# Altium schematic sheet rx_board.SchDoc
size A
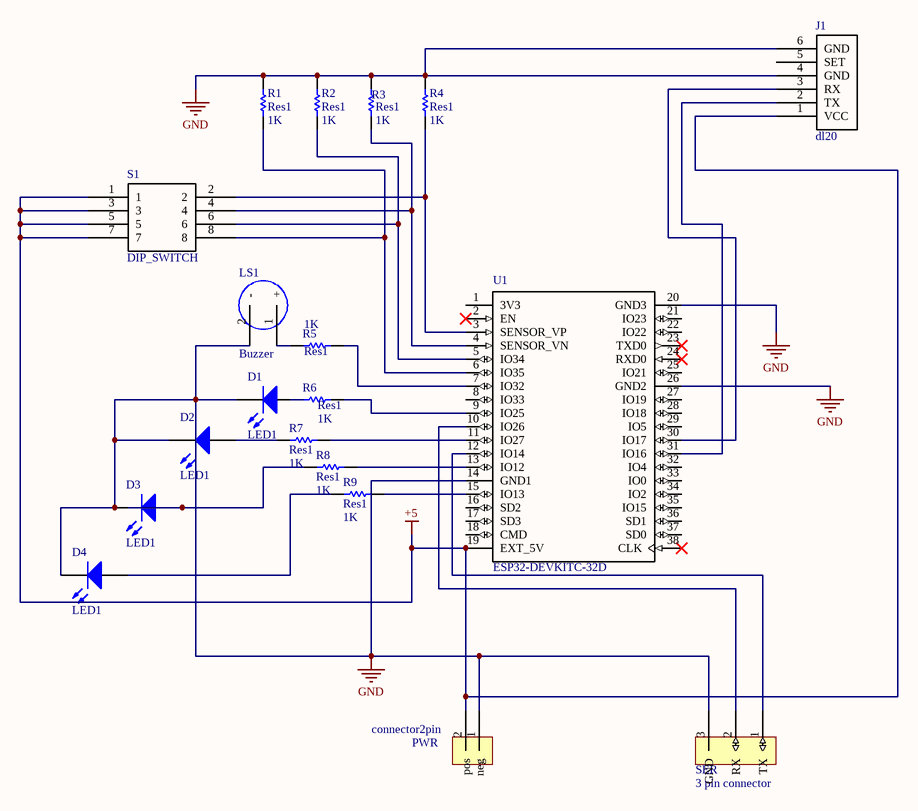
[diagram p0: rx_board.SchDoc]

## Parts
D1  LED1  [led3mm]
D2  LED1  [led3mm]
D3  LED1  [led3mm]
D4  LED1  [led3mm]
J1  dl20  [DL20]
LS1  Buzzer  [buzzer]
PWR  connector2pin  [connector2pin]
R1  Res1  value 1K  [J1-0603]
R2  Res1  value 1K  [J1-0603]
R3  Res1  value 1K  [J1-0603]
R4  Res1  value 1K  [J1-0603]
R5  Res1  value 1K  [J1-0603]
R6  Res1  value 1K  [J1-0603]
R7  Res1  value 1K  [J1-0603]
R8  Res1  value 1K  [J1-0603]
R9  Res1  value 1K  [J1-0603]
S1  DIP_SWITCH  [DIP_SWITCH_4_SPST]
SER  3 pin connector  [connector3pin]
U1  ESP32-DEVKITC-32D  [MODULE_ESP32-DEVKITC-32D]

## Nets
+5: J1.1(VCC) PWR.2(pos) S1.1 S1.3 S1.5 S1.7 U1.19(EXT_5V)
GND: D1.2(K) D2.2(K) D3.2(K) D4.2(K) J1.4(GND) J1.6(GND) LS1.2(-) PWR.1(neg) R1.1 R2.1 R3.1 R4.1 SER.3(GND) U1.14(GND1) U1.20(GND3) U1.26(GND2)
NetD1_1: D1.1(A) R6.1
NetD2_1: D2.1(A) R7.1
NetD3_1: D3.1(A) R8.1
NetD4_1: D4.1(A) R9.1
NetJ1_2: J1.2(TX) U1.31(IO16)
NetJ1_3: J1.3(RX) U1.30(IO17)
NetLS1_1: LS1.1(+) R5.1
NetR1_2: R1.2 S1.8 U1.6(IO35)
NetR2_2: R2.2 S1.6 U1.5(IO34)
NetR3_2: R3.2 S1.4 U1.4(SENSOR_VN)
NetR4_2: R4.2 S1.2 U1.3(SENSOR_VP)
NetR5_2: R5.2 U1.7(IO32)
NetR6_2: R6.2 U1.9(IO25)
NetR7_2: R7.2 U1.11(IO27)
NetR8_2: R8.2 U1.13(IO12)
NetR9_2: R9.2 U1.15(IO13)
NetSER_1: SER.1(TX) U1.12(IO14)
NetSER_2: SER.2(RX) U1.10(IO26)

Not connected (* = marked no-connect by the designer): J1 5(SET); U1 1(3V3) 2(EN)* 8(IO33) 16(SD2) 17(SD3) 18(CMD) 21(IO23) 22(IO22) 23(TXD0)* 24(RXD0)* 25(IO21) 27(IO19) 28(IO18) 29(IO5) 32(IO4) 33(IO0) 34(IO2) 35(IO15) 36(SD1) 37(SD0) 38(CLK)*

## Library data of the parts
D1-D4 = LED1: Typical RED GaAs LED; Published: 8-Jun-2000; LatestRevisionDate: 08-Jul-2005; LatestRevisionNote: Mech Layer 1 removed.; PackageReference: LED-1; Publisher: Altium Limited; PackageDescription: LED; 2 Leads
R1-R9 = Res1: Resistor; Published: 8-Jun-2000; LatestRevisionDate: 17-Jul-2002; LatestRevisionNote: Re-released for DXP Platform.; PackageReference: AXIAL-0.3; Publisher: Altium Limited; PackageDescription: Axial Device, Thru-Hole; 2 Leads; 0.3 in Pin Spacing
SER = CONNECTOR3PIN
U1 = ESP32-DEVKITC-32D: Eval Board For Esp-Wroom-32; MF: Espressif Systems; MP: ESP32-DEVKITC-32D; Price: None; SnapEDA_Link: https://www.snapeda.com/parts/ESP32-DEVKITC-32D/Espressif%20Systems/view-part/?ref=snap; Package: None; Availability: Unavailable; Value: *